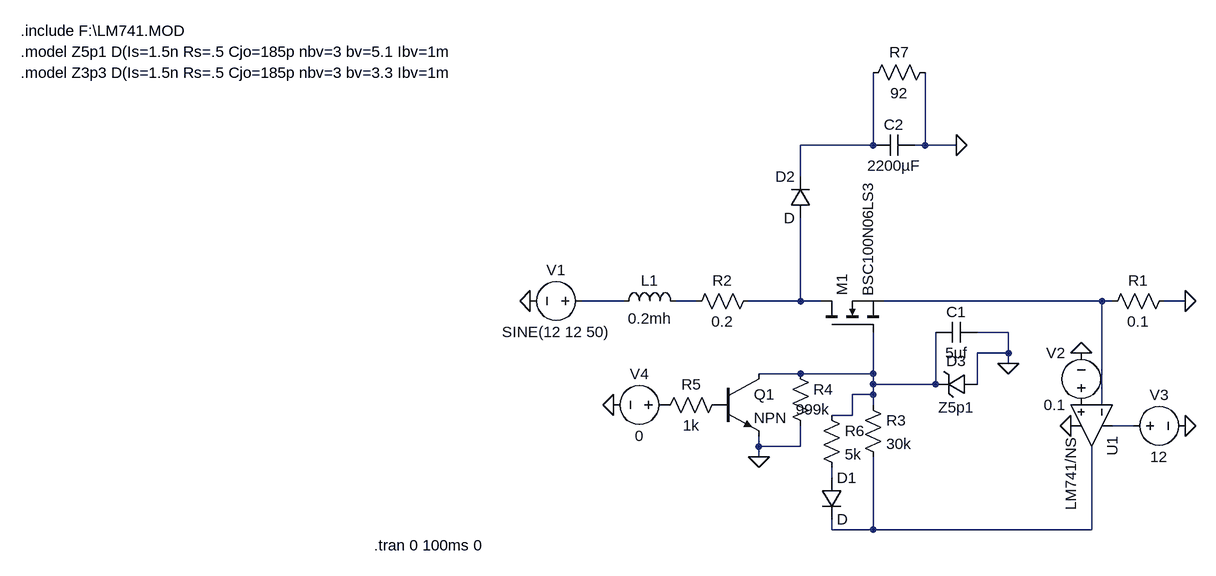
[diagram p0: schematic RL- OP AMP CURRENT CONTROL FOR ALTERNATING DC.asc]
RL- OP AMP CURRENT CONTROL FOR ALTERNATING DC.asc, the LTspice schematic file:
Version 4
SHEET 1 1540 680
WIRE 672 -128 672 -240
WIRE 672 -128 560 -128
WIRE 752 -128 752 -240
WIRE 752 -128 736 -128
WIRE 800 -128 752 -128
WIRE 560 -80 560 -128
WIRE 288 112 224 112
WIRE 400 112 368 112
WIRE 560 112 560 -16
WIRE 560 112 480 112
WIRE 592 112 560 112
WIRE 1024 112 688 112
WIRE 1040 112 1024 112
WIRE 1152 112 1120 112
WIRE 880 160 832 160
WIRE 880 192 880 160
WIRE 880 192 832 192
WIRE 880 208 880 192
WIRE 560 224 496 224
WIRE 672 224 672 160
WIRE 672 224 560 224
WIRE 672 240 672 224
WIRE 768 240 768 160
WIRE 768 240 672 240
WIRE 832 240 832 192
WIRE 672 256 672 240
WIRE 672 256 640 256
WIRE 672 272 672 256
WIRE 1024 272 1024 112
WIRE 640 288 640 256
WIRE 640 288 608 288
WIRE 1072 304 1040 304
WIRE 496 336 496 320
WIRE 560 336 560 304
WIRE 560 336 496 336
WIRE 496 352 496 336
WIRE 608 384 608 368
WIRE 608 464 608 448
WIRE 672 464 672 352
WIRE 672 464 608 464
WIRE 1008 464 1008 336
WIRE 1008 464 672 464
FLAG 144 112 0
FLAG 1152 304 0
FLAG 976 304 0
FLAG 992 192 0
FLAG 1152 112 0
FLAG 880 208 0
FLAG 496 352 0
FLAG 272 272 0
FLAG 800 -128 0
SYMBOL OpAmps\\opamp2 1072 304 R90
SYMATTR InstName U1
SYMATTR Value LM741/NS
SYMBOL nmos 592 160 R270
SYMATTR InstName M1
SYMATTR Value BSC100N06LS3
SYMBOL res 1136 96 R90
WINDOW 0 0 56 VBottom 2
WINDOW 3 32 56 VTop 2
SYMATTR InstName R1
SYMATTR Value 0.1
SYMBOL res 496 96 R90
WINDOW 0 0 56 VBottom 2
WINDOW 3 32 56 VTop 2
SYMATTR InstName R2
SYMATTR Value 0.2
SYMBOL voltage 240 112 R90
WINDOW 0 -32 56 VBottom 2
WINDOW 3 32 56 VTop 2
WINDOW 123 0 0 Left 0
WINDOW 39 0 0 Left 0
SYMATTR InstName V1
SYMATTR Value SINE(12 12 50)
SYMBOL voltage 1056 304 R270
WINDOW 0 32 56 VTop 2
WINDOW 3 -32 56 VBottom 2
WINDOW 123 0 0 Left 0
WINDOW 39 0 0 Left 0
SYMATTR InstName V3
SYMATTR Value 12
SYMBOL voltage 992 288 R180
WINDOW 0 24 96 Left 2
WINDOW 3 24 16 Left 2
WINDOW 123 0 0 Left 0
WINDOW 39 0 0 Left 0
SYMATTR InstName V2
SYMATTR Value 0.1
SYMBOL ind 272 128 R270
WINDOW 0 32 56 VTop 2
WINDOW 3 5 56 VBottom 2
SYMATTR InstName L1
SYMATTR Value 0.2mh
SYMBOL res 656 256 R0
SYMATTR InstName R3
SYMATTR Value 30k
SYMBOL cap 768 176 R270
WINDOW 0 32 32 VTop 2
WINDOW 3 0 32 VBottom 2
SYMATTR InstName C1
SYMATTR Value 5µf
SYMBOL npn 432 224 R0
SYMATTR InstName Q1
SYMBOL res 448 256 R90
WINDOW 0 0 56 VBottom 2
WINDOW 3 32 56 VTop 2
SYMATTR InstName R5
SYMATTR Value 1k
SYMBOL voltage 368 272 R90
WINDOW 0 -32 56 VBottom 2
WINDOW 3 32 56 VTop 2
WINDOW 123 0 0 Left 0
WINDOW 39 0 0 Left 0
SYMATTR InstName V4
SYMATTR Value 0
SYMBOL zener 832 224 R90
WINDOW 0 -4 32 VBottom 2
WINDOW 3 36 32 VTop 2
SYMATTR InstName D3
SYMATTR Value Z5p1
SYMBOL res 544 208 R0
WINDOW 3 9 71 Left 2
SYMATTR InstName R4
SYMATTR Value 999k
SYMBOL diode 592 384 R0
SYMATTR InstName D1
SYMBOL res 592 272 R0
SYMATTR InstName R6
SYMATTR Value 5k
SYMBOL cap 736 -144 R90
WINDOW 0 0 32 VBottom 2
WINDOW 3 32 32 VTop 2
SYMATTR InstName C2
SYMATTR Value 2200µF
SYMBOL res 768 -256 R90
WINDOW 0 0 56 VBottom 2
WINDOW 3 32 56 VTop 2
SYMATTR InstName R7
SYMATTR Value 92
SYMBOL diode 576 -16 R180
WINDOW 0 24 64 Left 2
WINDOW 3 24 0 Left 2
SYMATTR InstName D2
TEXT -640 -304 Left 2 !.include F:\\LM741.MOD
TEXT -96 488 Left 2 !.tran 0 100ms 0
TEXT -640 -272 Left 2 !.model Z5p1 D(Is=1.5n Rs=.5 Cjo=185p nbv=3 bv=5.1 Ibv=1m
TEXT -640 -240 Left 2 !.model Z3p3 D(Is=1.5n Rs=.5 Cjo=185p nbv=3 bv=3.3 Ibv=1m

The netlist it stands for:
* RL- OP AMP CURRENT CONTROL FOR ALTERNATING DC.asc
XU1 P001 N005 N007 0 N009 LM741/NS  ; pins In+ In- V+ V- OUT
M1 N004 N006 N005 N005 BSC100N06LS3
R1 0 N005 0.1
R2 N004 N003 0.2
V1 N002 0 SINE(12 12 50)
V3 N007 0 12
V2 P001 0 0.1
L1 N002 N003 0.2mh
R3 N006 N009 30k
C1 N006 0 5µf
Q1 N006 P002 0 0 NPN
R5 P002 P003 1k
V4 P003 0 0
D3 0 N006 Z5p1
R4 N006 0 999k
D1 N008 N009 D
R6 N006 N008 5k
C2 0 N001 2200µF
R7 0 N001 92
D2 N004 N001 D
.model D D
.lib standard.dio
.model NPN NPN
.model PNP PNP
.lib standard.bjt
.model NMOS NMOS
.model PMOS PMOS
.lib standard.mos
.include F:\LM741.MOD
.tran 0 100ms 0
.model Z5p1 D(Is=1.5n Rs=.5 Cjo=185p nbv=3 bv=5.1 Ibv=1m
.model Z3p3 D(Is=1.5n Rs=.5 Cjo=185p nbv=3 bv=3.3 Ibv=1m
.backanno
.end